# Altium schematic sheet TQFP Adapter.SchDoc
size A
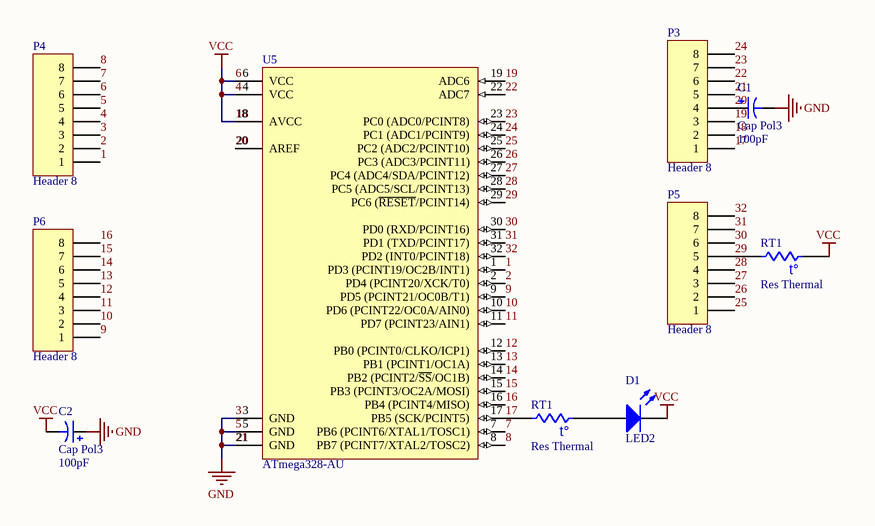
[diagram p0: TQFP Adapter.SchDoc]

## Parts
(Parts that share a designator on the sheet are numbered #1, #2 ... from top to bottom, then left to right.)
C1  Cap Pol3  value 100pF  [C0805]
C2  Cap Pol3  value 100pF  [C0805]
D1  LED2  [3.2X1.6X1.1]
P3  Header 8  [HDR1X8]
P4  Header 8  [HDR1X8]
P5  Header 8  [HDR1X8]
P6  Header 8  [HDR1X8]
RT1#1  Res Thermal  [6-0805_L]
RT1#2  Res Thermal  [6-0805_L]
U5  ATmega328-AU  [32A_N]

## Nets
18: C2.2 D1.2(K) P3.2 P4.4 P4.6 RT1#1.1 U5.4(VCC) U5.6(VCC) U5.18(AVCC)  [also labelled 4, 6, VCC]
21: C1.2 C2.1 P3.5 P4.3 P4.5 U5.3(GND) U5.5(GND) U5.21(GND)  [also labelled 3, 5, GND]
1: P4.1 U5.1(PD3_(PCINT19/OC2B/INT1))
2: P4.2 U5.2(PD4_(PCINT20/XCK/T0))
7: P4.7 U5.7(PB6_(PCINT6/XTAL1/TOSC1))
8: P4.8 U5.8(PB7_(PCINT7/XTAL2/TOSC2))
9: P6.1 U5.9(PD5_(PCINT21/OC0B/T1))
10: P6.2 U5.10(PD6_(PCINT22/OC0A/AIN0))
11: P6.3 U5.11(PD7_(PCINT23/AIN1))
12: P6.4 U5.12(PB0_(PCINT0/CLKO/ICP1))
13: P6.5 U5.13(PB1_(PCINT1/OC1A))
14: P6.6 U5.14(PB2_(PCINT2/~{SS}/OC1B))
15: P6.7 U5.15(PB3_(PCINT3/OC2A/MOSI))
16: P6.8 U5.16(PB4_(PCINT4/MISO))
17: P3.1 RT1#2.2 U5.17(PB5_(SCK/PCINT5))
19: P3.3 U5.19(ADC6)
20: C1.1 P3.4 U5.20(AREF)
22: P3.6 U5.22(ADC7)
23: P3.7 U5.23(PC0_(ADC0/PCINT8))
24: P3.8 U5.24(PC1_(ADC1/PCINT9))
25: P5.1 U5.25(PC2_(ADC2/PCINT10))
26: P5.2 U5.26(PC3_(ADC3/PCINT11))
27: P5.3 U5.27(PC4_(ADC4/SDA/PCINT12))
28: P5.4 U5.28(PC5_(ADC5/SCL/PCINT13))
29: P5.5 RT1#1.2 U5.29(PC6_(~{RESET}/PCINT14))
30: P5.6 U5.30(PD0_(RXD/PCINT16))
31: P5.7 U5.31(PD1_(TXD/PCINT17))
32: P5.8 U5.32(PD2_(INT0/PCINT18))
NetD1_1: D1.1(A) RT1#2.1

## Notes on the sheet
- (in symbol Res Thermal) t°

## Library data of the parts
C1 C2 = Cap Pol3: Polarized Capacitor (Surface Mount); Published: 8-Jun-2000; LatestRevisionDate: 29-May-2009; LatestRevisionNote: IPC-7351 Footprint Added.; PackageReference: C0805; Publisher: Altium Limited; PackageDescription: Chip Capacitor
D1 = LED2: Typical RED, GREEN, YELLOW, AMBER GaAs LED; Published: 8-Jun-2000; LatestRevisionDate: 17-Jul-2002; LatestRevisionNote: Re-released for DXP Platform.; PackageVersion: Feb-2002; PackageReference: 3.2X1.6X1.1; Publisher: Altium Limited; PackageDescription: SM LED; 2 Flat Leads
P3-P6 = Header 8: Header, 8-Pin; LatestRevisionDate: 17-Jul-2002; LatestRevisionNote: Re-released for DXP Platform.; Publisher: Altium Limited
RT1#1 RT1#2 = Res Thermal: Thermistor; Published: 24-Mar-1999; LatestRevisionDate: 29-May-2009; LatestRevisionNote: IPC-7351 Footprint Added.; PackageVersion: Mar-2003; PackageReference: 6-0805; Publisher: Altium Limited; PackageDescription: Chip Resistor 0805 Case Size; Code_IPC: RESC2012
U5 = ATmega328-AU: 8-bit AVR Microcontroller, 32KB Flash, 1KB EEPROM, 2KB SRAM, 32-pin TQFP, Industrial Grade (-40°C to 85°C); Published: 1-Apr-2010; DatasheetVersion: revA, Jan-2010; PackageVersion: revB, Oct-2001; PackageReference: 32A; Publisher: Altium Limited; PackageDescription: 32-Lead, 7x7x1.0 mm Body, 0.8mm Lead Pitch, Thin Profile Plastic Quad Flat Package (TQFP); Supplier 1: Digi-Key; Supplier Part Number 1: ATMEGA328-AU-ND; Supplier 2: Mouser; Supplier Part Number 2: 556-ATMEGA328-AU; Code_JEDEC: MS-026-ABA; ComponentLink1Description: Manufacturer Link; ComponentLink1URL: http://www.atmel.com/products/avr/default.asp?; ComponentLink2Description: ATmega48A/48PA/88A/88PA/168A/168PA/328/328P Datasheet; ComponentLink2URL: http://www.atmel.com/dyn/resources/prod_documents/8271.pdf; ComponentLink3Description: ATmega48A/48PA/88A/88PA/168A/168PA/328/328P Summary; ComponentLink3URL: http://www.atmel.com/dyn/resources/prod_documents/8271S.pdf; ComponentLink4Description: Atmel.com Home; ComponentLink4URL: http://www.atmel.com